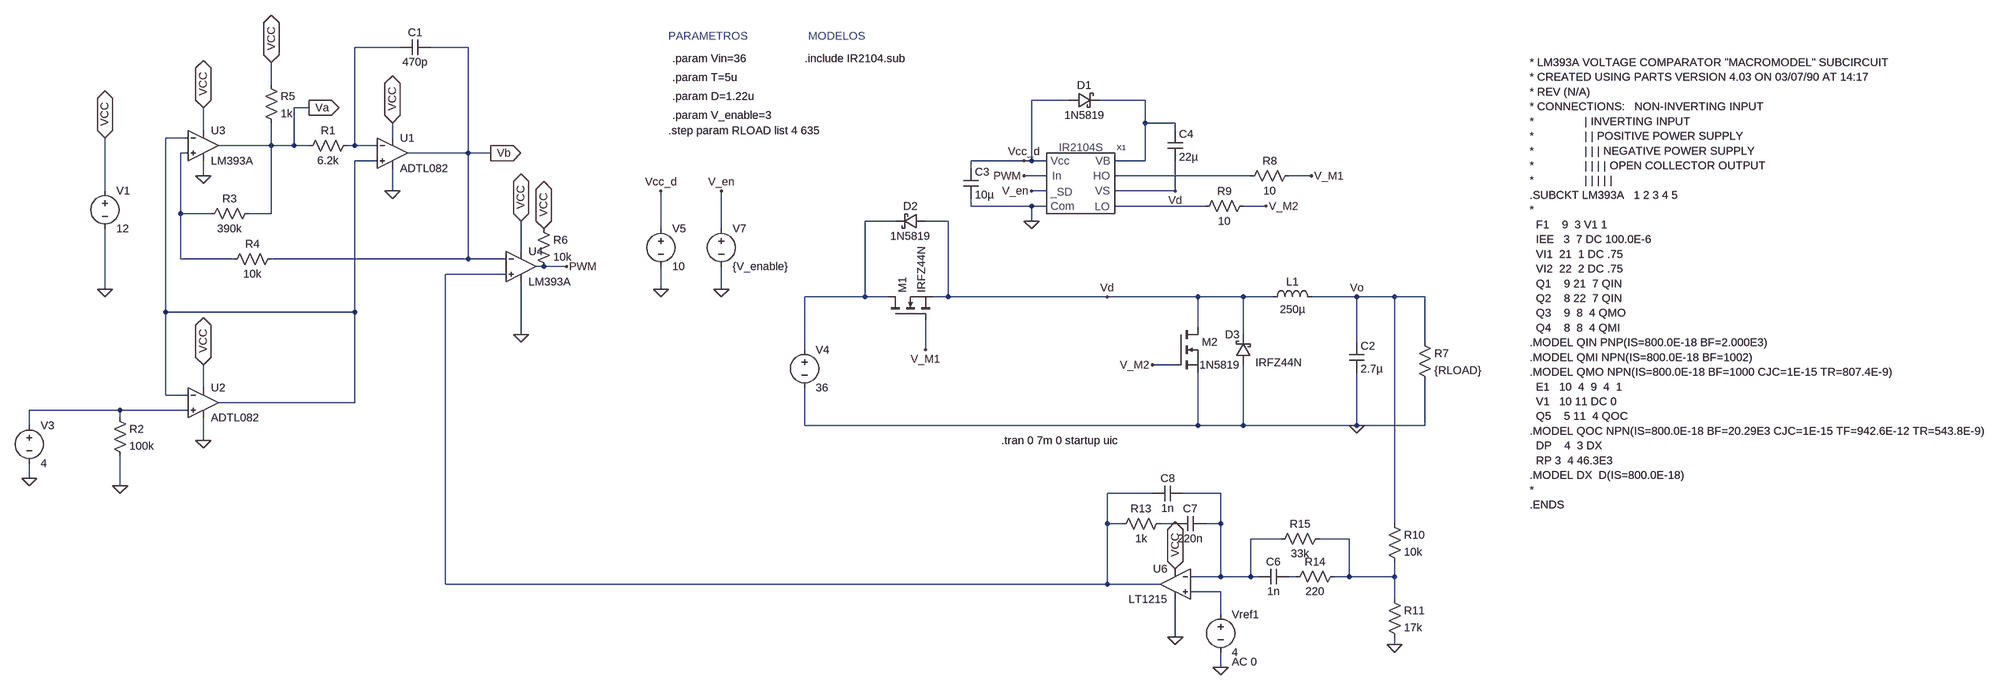
[diagram p0: schematic buck_lazo_cerrado.asc]
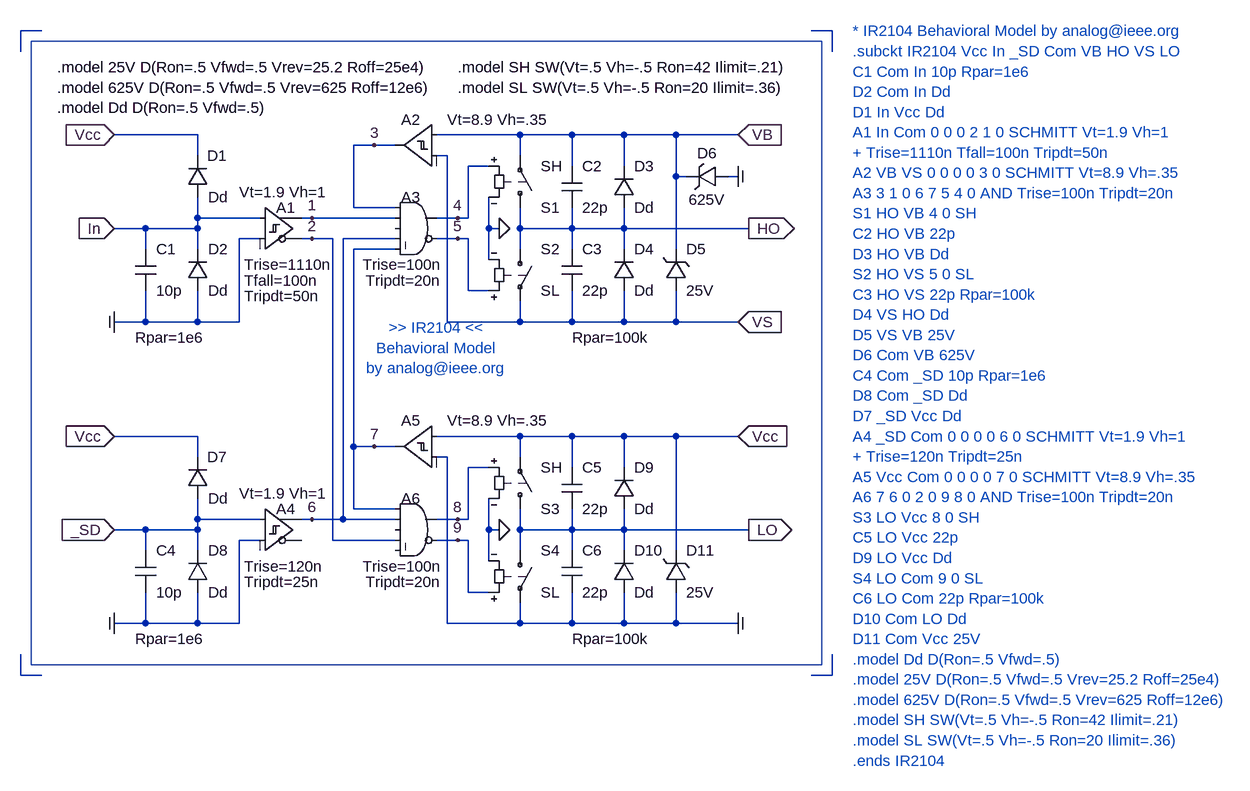
[diagram p1: sub-circuit ir2104.asc]
buck_lazo_cerrado.asc, the LTspice schematic file:
Version 4
SHEET 1 4080 1172
WIRE 528 -288 432 -288
WIRE 672 -288 592 -288
WIRE 256 -208 256 -256
WIRE 1952 -176 1872 -176
WIRE 2112 -176 2016 -176
WIRE 336 -160 304 -160
WIRE 2112 -128 2112 -176
WIRE 2176 -128 2112 -128
WIRE 112 -112 112 -160
WIRE 2176 -112 2176 -128
WIRE 80 -96 32 -96
WIRE 512 -96 512 -128
WIRE 256 -80 256 -128
WIRE 256 -80 144 -80
WIRE 304 -80 304 -160
WIRE 304 -80 256 -80
WIRE 336 -80 304 -80
WIRE 432 -80 432 -288
WIRE 432 -80 416 -80
WIRE 480 -80 432 -80
WIRE 80 -64 64 -64
WIRE 672 -64 672 -288
WIRE 672 -64 544 -64
WIRE 720 -64 672 -64
WIRE 480 -48 432 -48
WIRE 1856 -48 1744 -48
WIRE 1872 -48 1872 -176
WIRE 1872 -48 1856 -48
WIRE 1904 -48 1872 -48
WIRE 2112 -48 2112 -128
WIRE 2112 -48 2048 -48
WIRE 1744 -32 1744 -48
WIRE 112 -16 112 -48
WIRE 1904 -16 1856 -16
WIRE 2336 -16 2048 -16
WIRE 2464 -16 2416 -16
WIRE -96 16 -96 -96
WIRE 512 16 512 -32
WIRE 1904 16 1872 16
WIRE 2176 16 2176 -48
WIRE 2176 16 2048 16
WIRE 1744 48 1744 32
WIRE 1872 48 1744 48
WIRE 1904 48 1872 48
WIRE 2240 48 2048 48
WIRE 2368 48 2320 48
WIRE 64 64 64 -64
WIRE 128 64 64 64
WIRE 256 64 256 -80
WIRE 256 64 208 64
WIRE 1584 80 1520 80
WIRE 1696 80 1648 80
WIRE 1872 80 1872 48
WIRE 1088 96 1088 16
WIRE 1216 96 1216 16
WIRE 784 144 784 80
WIRE 64 160 64 64
WIRE 176 160 64 160
WIRE 672 160 672 -64
WIRE 672 160 256 160
WIRE 752 160 672 160
WIRE 832 176 816 176
WIRE 880 176 832 176
WIRE 752 192 624 192
WIRE -96 224 -96 96
WIRE 1088 224 1088 176
WIRE 1216 224 1216 176
WIRE 1520 240 1520 80
WIRE 1520 240 1392 240
WIRE 1568 240 1520 240
WIRE 1696 240 1696 80
WIRE 1696 240 1664 240
WIRE 2032 240 1696 240
WIRE 2224 240 2032 240
WIRE 2320 240 2224 240
WIRE 2384 240 2320 240
WIRE 2560 240 2464 240
WIRE 2640 240 2560 240
WIRE 2704 240 2640 240
WIRE 32 272 32 -96
WIRE 432 272 432 -48
WIRE 432 272 32 272
WIRE 2224 304 2224 240
WIRE 784 320 784 208
WIRE 2320 320 2320 240
WIRE 2560 336 2560 240
WIRE 2704 336 2704 240
WIRE 1392 352 1392 240
WIRE 1648 352 1648 288
WIRE 2176 384 2128 384
WIRE 112 432 112 384
WIRE 32 448 32 272
WIRE 80 448 32 448
WIRE 432 464 432 272
WIRE 432 464 144 464
WIRE -64 480 -256 480
WIRE 80 480 -64 480
WIRE -64 496 -64 480
WIRE -256 512 -256 480
WIRE 1392 512 1392 432
WIRE 2224 512 2224 400
WIRE 2224 512 1392 512
WIRE 2320 512 2320 384
WIRE 2320 512 2224 512
WIRE 2560 512 2560 400
WIRE 2560 512 2320 512
WIRE 2704 512 2704 416
WIRE 2704 512 2560 512
WIRE 112 544 112 496
WIRE -256 624 -256 592
WIRE -64 640 -64 576
WIRE 2128 656 2032 656
WIRE 2272 656 2192 656
WIRE 2032 720 2032 656
WIRE 2064 720 2032 720
WIRE 2176 720 2144 720
WIRE 2272 720 2272 656
WIRE 2272 720 2240 720
WIRE 2640 720 2640 240
WIRE 2400 752 2336 752
WIRE 2544 752 2480 752
WIRE 2272 832 2272 720
WIRE 2272 832 2208 832
WIRE 2336 832 2336 752
WIRE 2336 832 2272 832
WIRE 2352 832 2336 832
WIRE 2432 832 2416 832
WIRE 2544 832 2544 752
WIRE 2544 832 2512 832
WIRE 2640 832 2640 800
WIRE 2640 832 2544 832
WIRE 624 848 624 192
WIRE 2032 848 2032 720
WIRE 2032 848 624 848
WIRE 2144 848 2032 848
WIRE 2272 864 2208 864
WIRE 2640 880 2640 832
WIRE 2272 912 2272 864
WIRE 2176 960 2176 880
WIRE 2640 976 2640 960
WIRE 2272 1024 2272 992
FLAG -64 640 0
FLAG -96 224 0
FLAG 512 16 0
FLAG 112 544 0
FLAG 784 320 0
FLAG 112 -16 0
FLAG -96 -96 VCC
IOPIN -96 -96 BiDir
FLAG 112 -160 VCC
IOPIN 112 -160 BiDir
FLAG 512 -128 VCC
IOPIN 512 -128 BiDir
FLAG 112 384 VCC
IOPIN 112 384 BiDir
FLAG 336 -160 Va
IOPIN 336 -160 Out
FLAG 720 -64 Vb
IOPIN 720 -64 Out
FLAG 784 80 VCC
IOPIN 784 80 BiDir
FLAG -256 624 0
FLAG 256 -256 VCC
IOPIN 256 -256 BiDir
FLAG 832 96 VCC
IOPIN 832 96 BiDir
FLAG 2560 512 0
FLAG 2560 240 Vo
FLAG 2032 240 Vd
FLAG 1856 -16 PWM
FLAG 1088 224 0
FLAG 1088 16 Vcc_d
FLAG 1856 -48 Vcc_d
FLAG 2176 16 Vd
FLAG 1872 80 0
FLAG 2464 -16 V_M1
FLAG 2368 48 V_M2
FLAG 1648 352 V_M1
FLAG 2128 384 V_M2
FLAG 1872 16 V_en
FLAG 1216 224 0
FLAG 1216 16 V_en
FLAG 880 176 PWM
FLAG 2176 960 0
FLAG 2272 1024 0
FLAG 2640 976 0
FLAG 2176 816 VCC
IOPIN 2176 816 BiDir
SYMBOL res 432 -96 R90
WINDOW 0 0 56 VBottom 2
WINDOW 3 32 56 VTop 2
SYMATTR InstName R1
SYMATTR Value 6.2k
SYMBOL res -80 480 R0
SYMATTR InstName R2
SYMATTR Value 100k
SYMBOL voltage -96 0 R0
WINDOW 123 0 0 Left 0
WINDOW 39 0 0 Left 0
SYMATTR InstName V1
SYMATTR Value 12
SYMBOL res 224 48 R90
WINDOW 0 0 56 VBottom 2
WINDOW 3 32 56 VTop 2
SYMATTR InstName R3
SYMATTR Value 390k
SYMBOL res 272 144 R90
WINDOW 0 0 56 VBottom 2
WINDOW 3 32 56 VTop 2
SYMATTR InstName R4
SYMATTR Value 10k
SYMBOL cap 592 -304 R90
WINDOW 0 0 32 VBottom 2
WINDOW 3 32 32 VTop 2
SYMATTR InstName C1
SYMATTR Value 470p
SYMBOL OpAmps\\ADTL082 512 -128 R0
SYMATTR InstName U1
SYMBOL OpAmps\\ADTL082 112 400 R0
SYMATTR InstName U2
SYMBOL voltage -256 496 R0
WINDOW 123 0 0 Left 0
WINDOW 39 0 0 Left 0
SYMATTR InstName V3
SYMATTR Value 4
SYMBOL OpAmps\\opamp2 112 -144 R0
SYMATTR InstName U3
SYMATTR Value LM393A
SYMBOL res 240 -224 R0
SYMATTR InstName R5
SYMATTR Value 1k
SYMBOL OpAmps\\opamp2 784 112 R0
SYMATTR InstName U4
SYMATTR Value LM393A
SYMBOL res 816 80 R0
SYMATTR InstName R6
SYMATTR Value 10k
SYMBOL voltage 1392 336 R0
WINDOW 123 0 0 Left 0
WINDOW 39 0 0 Left 0
SYMATTR InstName V4
SYMATTR Value 36
SYMBOL ind 2368 256 R270
WINDOW 0 32 56 VTop 2
WINDOW 3 5 56 VBottom 2
SYMATTR InstName L1
SYMATTR Value 250µ
SYMBOL cap 2544 336 R0
SYMATTR InstName C2
SYMATTR Value 2.7µ
SYMBOL res 2688 320 R0
SYMATTR InstName R7
SYMATTR Value {RLOAD}
SYMBOL nmos 1568 288 R270
SYMATTR InstName M1
SYMATTR Value IRFZ44N
SYMBOL nmos 2176 304 R0
WINDOW 3 170 75 Left 2
SYMATTR Value IRFZ44N
SYMATTR InstName M2
SYMBOL voltage 1088 80 R0
SYMATTR InstName V5
SYMATTR Value 10
SYMBOL cap 1728 -32 R0
SYMATTR InstName C3
SYMATTR Value 10µ
SYMBOL schottky 1952 -160 R270
WINDOW 0 32 32 VTop 2
WINDOW 3 0 32 VBottom 2
SYMATTR InstName D1
SYMATTR Value 1N5819
SYMATTR Description Diode
SYMATTR Type diode
SYMBOL res 2432 -32 R90
WINDOW 0 0 56 VBottom 2
WINDOW 3 32 56 VTop 2
SYMATTR InstName R8
SYMATTR Value 10
SYMBOL res 2336 32 R90
WINDOW 0 0 56 VBottom 2
WINDOW 3 32 56 VTop 2
SYMATTR InstName R9
SYMATTR Value 10
SYMBOL cap 2160 -112 R0
SYMATTR InstName C4
SYMATTR Value 22µ
SYMBOL voltage 1216 80 R0
WINDOW 123 0 0 Left 0
WINDOW 39 0 0 Left 0
SYMATTR InstName V7
SYMATTR Value {V_enable}
SYMBOL ir2104 1936 -32 R0
SYMATTR InstName X1
SYMBOL cap 2416 816 R90
WINDOW 0 0 32 VBottom 2
WINDOW 3 32 32 VTop 2
SYMATTR InstName C6
SYMATTR Value 1n
SYMBOL cap 2240 704 R90
WINDOW 0 0 32 VBottom 2
WINDOW 3 32 32 VTop 2
SYMATTR InstName C7
SYMATTR Value 220n
SYMBOL res 2160 704 R90
WINDOW 0 0 56 VBottom 2
WINDOW 3 32 56 VTop 2
SYMATTR InstName R13
SYMATTR Value 1k
SYMBOL res 2528 816 R90
WINDOW 0 0 56 VBottom 2
WINDOW 3 32 56 VTop 2
SYMATTR InstName R14
SYMATTR Value 220
SYMBOL res 2496 736 R90
WINDOW 0 0 56 VBottom 2
WINDOW 3 32 56 VTop 2
SYMATTR InstName R15
SYMATTR Value 33k
SYMBOL voltage 2272 896 R0
WINDOW 123 24 116 Left 2
WINDOW 39 0 0 Left 2
SYMATTR Value2 AC 0
SYMATTR InstName Vref1
SYMATTR Value 4
SYMBOL cap 2192 640 R90
WINDOW 0 0 32 VBottom 2
WINDOW 3 32 32 VTop 2
SYMATTR InstName C8
SYMATTR Value 1n
SYMBOL res 2624 704 R0
SYMATTR InstName R10
SYMATTR Value 10k
SYMBOL res 2624 864 R0
SYMATTR InstName R11
SYMATTR Value 17k
SYMBOL schottky 1648 64 R90
WINDOW 0 0 32 VBottom 2
WINDOW 3 32 32 VTop 2
SYMATTR InstName D2
SYMATTR Value 1N5819
SYMATTR Description Diode
SYMATTR Type diode
SYMBOL schottky 2336 384 R180
WINDOW 0 24 64 Left 2
WINDOW 3 24 0 Left 2
SYMATTR InstName D3
SYMATTR Value 1N5819
SYMATTR Description Diode
SYMATTR Type diode
SYMBOL OpAmps\\LT1215 2176 784 M0
SYMATTR InstName U6
TEXT 1808 544 Left 2 !.tran 0 7m 0 startup uic
TEXT 1392 -264 Left 2 !.include IR2104.sub
TEXT 1112 -264 Left 2 !.param Vin=36
TEXT 1104 -312 Left 2 ;PARAMETROS
TEXT 1112 -224 Left 2 !.param T=5u
TEXT 1112 -184 Left 2 !.param D=1.22u
TEXT 1112 -144 Left 2 !.param V_enable=3
TEXT 1400 -312 Left 2 ;MODELOS
TEXT 3072 -256 Left 2 !* LM393A VOLTAGE COMPARATOR "MACROMODEL" SUBCIRCUIT\n* CREATED USING PARTS VERSION 4.03 ON 03/07/90 AT 14:17\n* REV (N/A)\n* CONNECTIONS:   NON-INVERTING INPUT\n*                | INVERTING INPUT\n*                | | POSITIVE POWER SUPPLY\n*                | | | NEGATIVE POWER SUPPLY\n*                | | | | OPEN COLLECTOR OUTPUT\n*                | | | | |\n.SUBCKT LM393A   1 2 3 4 5\n*\n  F1    9  3 V1 1\n  IEE   3  7 DC 100.0E-6\n  VI1  21  1 DC .75\n  VI2  22  2 DC .75\n  Q1    9 21  7 QIN\n  Q2    8 22  7 QIN\n  Q3    9  8  4 QMO\n  Q4    8  8  4 QMI\n.MODEL QIN PNP(IS=800.0E-18 BF=2.000E3)\n.MODEL QMI NPN(IS=800.0E-18 BF=1002)\n.MODEL QMO NPN(IS=800.0E-18 BF=1000 CJC=1E-15 TR=807.4E-9)\n  E1   10  4  9  4  1\n  V1   10 11 DC 0\n  Q5    5 11  4 QOC\n.MODEL QOC NPN(IS=800.0E-18 BF=20.29E3 CJC=1E-15 TF=942.6E-12 TR=543.8E-9)\n  DP    4  3 DX\n  RP 3  4 46.3E3\n.MODEL DX  D(IS=800.0E-18)\n*\n.ENDS
TEXT 1104 -112 Left 2 !.step param RLOAD list 4 635

ir2104.asc, the sub-circuit schematic file:
Version 4
SHEET 1 1888 1048
WIRE -400 -560 -400 -592
WIRE -400 400 -400 368
WIRE -368 -592 -400 -592
WIRE -368 400 -400 400
WIRE -208 -288 -256 -288
WIRE -208 -256 -208 -288
WIRE -208 -144 -256 -144
WIRE -208 -144 -208 -192
WIRE -208 176 -256 176
WIRE -208 208 -208 176
WIRE -208 320 -256 320
WIRE -208 320 -208 272
WIRE -128 -432 -256 -432
WIRE -128 -400 -128 -432
WIRE -128 -304 -128 -336
WIRE -128 -288 -208 -288
WIRE -128 -288 -128 -304
WIRE -128 -256 -128 -288
WIRE -128 -144 -208 -144
WIRE -128 -144 -128 -192
WIRE -128 32 -256 32
WIRE -128 64 -128 32
WIRE -128 160 -128 128
WIRE -128 176 -208 176
WIRE -128 176 -128 160
WIRE -128 208 -128 176
WIRE -128 320 -208 320
WIRE -128 320 -128 272
WIRE -64 -144 -128 -144
WIRE -64 -144 -64 -272
WIRE -64 320 -128 320
WIRE -64 320 -64 192
WIRE -32 -304 -128 -304
WIRE -32 -272 -64 -272
WIRE -32 160 -128 160
WIRE -32 192 -64 192
WIRE 48 -304 32 -304
WIRE 48 -272 32 -272
WIRE 48 160 32 160
WIRE 80 -272 48 -272
WIRE 80 192 80 -272
WIRE 96 160 48 160
WIRE 96 160 96 -272
WIRE 112 -320 112 -416
WIRE 112 48 112 -256
WIRE 112 144 112 48
WIRE 144 -416 112 -416
WIRE 144 48 112 48
WIRE 176 -416 144 -416
WIRE 176 -320 112 -320
WIRE 176 -304 48 -304
WIRE 176 -272 96 -272
WIRE 176 -256 112 -256
WIRE 176 48 144 48
WIRE 176 144 112 144
WIRE 176 160 96 160
WIRE 176 192 80 192
WIRE 256 -400 240 -400
WIRE 256 -144 256 -400
WIRE 256 64 240 64
WIRE 256 320 256 64
WIRE 272 -304 240 -304
WIRE 272 -272 240 -272
WIRE 272 160 240 160
WIRE 272 192 240 192
WIRE 288 -304 272 -304
WIRE 288 -304 288 -384
WIRE 288 -272 272 -272
WIRE 288 -192 288 -272
WIRE 288 160 272 160
WIRE 288 160 288 80
WIRE 288 192 272 192
WIRE 288 272 288 192
WIRE 320 -384 288 -384
WIRE 320 -288 320 -336
WIRE 320 -240 320 -288
WIRE 320 -192 288 -192
WIRE 320 80 288 80
WIRE 320 176 320 128
WIRE 320 224 320 176
WIRE 320 272 288 272
WIRE 336 -288 320 -288
WIRE 336 176 320 176
WIRE 368 -432 240 -432
WIRE 368 -400 368 -432
WIRE 368 -288 368 -320
WIRE 368 -256 368 -288
WIRE 368 -144 256 -144
WIRE 368 -144 368 -176
WIRE 368 32 240 32
WIRE 368 64 368 32
WIRE 368 176 368 144
WIRE 368 208 368 176
WIRE 368 320 256 320
WIRE 368 320 368 288
WIRE 448 -432 368 -432
WIRE 448 -384 448 -432
WIRE 448 -288 368 -288
WIRE 448 -288 448 -320
WIRE 448 -256 448 -288
WIRE 448 -144 368 -144
WIRE 448 -144 448 -192
WIRE 448 32 368 32
WIRE 448 80 448 32
WIRE 448 176 368 176
WIRE 448 176 448 144
WIRE 448 208 448 176
WIRE 448 320 368 320
WIRE 448 320 448 272
WIRE 528 -432 448 -432
WIRE 528 -384 528 -432
WIRE 528 -288 448 -288
WIRE 528 -288 528 -320
WIRE 528 -256 528 -288
WIRE 528 -144 448 -144
WIRE 528 -144 528 -192
WIRE 528 32 448 32
WIRE 528 80 528 32
WIRE 528 176 448 176
WIRE 528 176 528 144
WIRE 528 208 528 176
WIRE 528 320 448 320
WIRE 528 320 528 272
WIRE 608 -432 528 -432
WIRE 608 -368 608 -432
WIRE 608 -256 608 -368
WIRE 608 -144 528 -144
WIRE 608 -144 608 -192
WIRE 608 32 528 32
WIRE 608 208 608 32
WIRE 608 320 528 320
WIRE 608 320 608 272
WIRE 624 -368 608 -368
WIRE 704 -432 608 -432
WIRE 704 -368 688 -368
WIRE 704 -144 608 -144
WIRE 704 32 608 32
WIRE 704 320 608 320
WIRE 720 -288 528 -288
WIRE 720 176 528 176
WIRE 848 -592 816 -592
WIRE 848 -560 848 -592
WIRE 848 400 816 400
WIRE 848 400 848 368
FLAG 720 -288 HO
IOPIN 720 -288 Out
FLAG -256 -288 In
IOPIN -256 -288 In
FLAG -256 -432 Vcc
IOPIN -256 -432 In
FLAG 704 -432 VB
IOPIN 704 -432 In
FLAG 704 -144 VS
IOPIN 704 -144 In
FLAG -256 -144 Com
IOPIN -256 -144 In
FLAG 704 -368 Com
IOPIN 704 -368 In
FLAG -256 176 _SD
IOPIN -256 176 In
FLAG -256 32 Vcc
IOPIN -256 32 In
FLAG -256 320 Com
IOPIN -256 320 In
FLAG 704 32 Vcc
IOPIN 704 32 In
FLAG 704 320 Com
IOPIN 704 320 In
FLAG 720 176 LO
IOPIN 720 176 Out
FLAG 48 -304 1
FLAG 48 -272 2
FLAG 144 -416 3
FLAG 336 176 0
FLAG 336 -288 0
FLAG 144 48 7
FLAG 272 -304 4
FLAG 272 -272 5
FLAG 48 160 6
FLAG 272 160 8
FLAG 272 192 9
SYMBOL diode -144 -336 M180
WINDOW 0 31 64 Left 0
WINDOW 3 32 0 Left 0
SYMATTR InstName D1
SYMATTR Value Dd
SYMBOL diode -144 -192 M180
WINDOW 0 32 64 Left 0
WINDOW 3 32 0 Left 0
SYMATTR InstName D2
SYMATTR Value Dd
SYMBOL diode 512 -320 M180
WINDOW 0 32 64 Left 0
WINDOW 3 32 0 Left 0
SYMATTR InstName D3
SYMATTR Value Dd
SYMBOL diode 512 -192 M180
WINDOW 0 32 64 Left 0
WINDOW 3 32 0 Left 0
SYMATTR InstName D4
SYMATTR Value Dd
SYMBOL zener 592 -192 M180
WINDOW 0 32 64 Left 0
WINDOW 3 32 0 Left 0
SYMATTR InstName D5
SYMATTR Value 25V
SYMBOL cap 432 -384 R0
WINDOW 0 32 0 Left 0
WINDOW 3 32 64 Left 0
SYMATTR InstName C2
SYMATTR Value 22p
SYMBOL cap 432 -256 R0
WINDOW 0 32 0 Left 0
WINDOW 3 32 64 Left 0
WINDOW 39 16 136 Left 0
SYMATTR InstName C3
SYMATTR Value 22p
SYMATTR SpiceLine Rpar=100k
SYMBOL sw 368 -304 M180
WINDOW 0 32 16 Left 0
WINDOW 3 32 80 Left 0
SYMATTR InstName S1
SYMATTR Value SH
SYMBOL sw 368 -272 R0
WINDOW 0 32 16 Left 0
WINDOW 3 32 80 Left 0
SYMATTR InstName S2
SYMATTR Value SL
SYMBOL Digital\\diffschmtbuf 240 -480 M0
WINDOW 0 40 25 Center 0
WINDOW 3 -16 25 Right 0
SYMATTR InstName A2
SYMATTR Value Vt=8.9 Vh=.35
SYMBOL cap -224 -256 R0
WINDOW 0 32 0 Left 0
WINDOW 3 32 64 Left 0
WINDOW 39 0 136 Left 0
SYMATTR InstName C1
SYMATTR Value 10p
SYMATTR SpiceLine Rpar=1e6
SYMBOL zener 688 -352 M270
WINDOW 0 36 32 VTop 0
WINDOW 3 -4 32 VBottom 0
SYMATTR InstName D6
SYMATTR Value 625V
SYMBOL diode -144 128 M180
WINDOW 0 31 64 Left 0
WINDOW 3 32 0 Left 0
SYMATTR InstName D7
SYMATTR Value Dd
SYMBOL diode -144 272 M180
WINDOW 0 32 64 Left 0
WINDOW 3 32 0 Left 0
SYMATTR InstName D8
SYMATTR Value Dd
SYMBOL Digital\\diffschmitt -32 112 R0
WINDOW 0 40 32 Center 0
WINDOW 3 -32 8 Left 0
WINDOW 123 -24 120 Left 0
WINDOW 39 -24 144 Left 0
SYMATTR InstName A4
SYMATTR Value Vt=1.9 Vh=1
SYMATTR Value2 Trise=120n
SYMATTR SpiceLine Tripdt=25n
SYMBOL Digital\\diffschmtbuf 240 -16 M0
WINDOW 0 40 24 Center 0
WINDOW 3 -16 24 Right 0
SYMATTR InstName A5
SYMATTR Value Vt=8.9 Vh=.35
SYMBOL cap -224 208 R0
WINDOW 0 32 0 Left 0
WINDOW 3 32 64 Left 0
WINDOW 39 0 136 Left 0
SYMATTR InstName C4
SYMATTR Value 10p
SYMATTR SpiceLine Rpar=1e6
SYMBOL sw 368 160 M180
WINDOW 0 32 16 Left 0
WINDOW 3 32 80 Left 0
SYMATTR InstName S3
SYMATTR Value SH
SYMBOL sw 368 192 R0
WINDOW 0 32 16 Left 0
WINDOW 3 32 80 Left 0
SYMATTR InstName S4
SYMATTR Value SL
SYMBOL diode 512 144 M180
WINDOW 0 32 64 Left 0
WINDOW 3 32 0 Left 0
SYMATTR InstName D9
SYMATTR Value Dd
SYMBOL diode 512 272 M180
WINDOW 0 32 64 Left 0
WINDOW 3 32 0 Left 0
SYMATTR InstName D10
SYMATTR Value Dd
SYMBOL zener 592 272 M180
WINDOW 0 32 64 Left 0
WINDOW 3 32 0 Left 0
SYMATTR InstName D11
SYMATTR Value 25V
SYMBOL cap 432 80 R0
WINDOW 0 32 0 Left 0
WINDOW 3 32 64 Left 0
SYMATTR InstName C5
SYMATTR Value 22p
SYMBOL cap 432 208 R0
WINDOW 0 32 0 Left 0
WINDOW 3 32 64 Left 0
WINDOW 39 16 136 Left 0
SYMATTR InstName C6
SYMATTR Value 22p
SYMATTR SpiceLine Rpar=100k
SYMBOL Digital\\and 208 -352 R0
WINDOW 0 -8 16 Center 0
WINDOW 3 40 120 Right 0
WINDOW 123 40 144 Right 0
SYMATTR InstName A3
SYMATTR Value Trise=100n
SYMATTR Value2 Tripdt=20n
SYMBOL Digital\\and 208 112 R0
WINDOW 0 -8 16 Center 0
WINDOW 3 40 120 Right 0
WINDOW 123 40 144 Right 0
SYMATTR InstName A6
SYMATTR Value Trise=100n
SYMATTR Value2 Tripdt=20n
SYMBOL Digital\\diffschmitt -32 -352 R0
WINDOW 0 40 32 Center 0
WINDOW 3 -32 8 Left 0
WINDOW 123 -24 120 Left 0
WINDOW 39 -24 144 Left 0
WINDOW 40 -24 168 Left 0
SYMATTR InstName A1
SYMATTR Value Vt=1.9 Vh=1
SYMATTR Value2 Trise=1110n
SYMATTR SpiceLine Tfall=100n
SYMATTR SpiceLine2 Tripdt=50n
TEXT 240 -104 Center 0 ;>> IR2104 <<\nBehavioral Model\nby analog@ieee.org
TEXT -344 -536 Left 0 !.model 25V D(Ron=.5 Vfwd=.5 Vrev=25.2 Roff=25e4)\n.model 625V D(Ron=.5 Vfwd=.5 Vrev=625 Roff=12e6)\n.model Dd D(Ron=.5 Vfwd=.5)
TEXT 272 -536 Left 0 !.model SH SW(Vt=.5 Vh=-.5 Ron=42 Ilimit=.21)\n.model SL SW(Vt=.5 Vh=-.5 Ron=20 Ilimit=.36)
TEXT 880 -592 Left 0 ;* IR2104 Behavioral Model by analog@ieee.org\n.subckt IR2104 Vcc In _SD Com VB HO VS LO\nC1 Com In 10p Rpar=1e6\nD2 Com In Dd\nD1 In Vcc Dd\nA1 In Com 0 0 0 2 1 0 SCHMITT Vt=1.9 Vh=1\n+ Trise=1110n Tfall=100n Tripdt=50n\nA2 VB VS 0 0 0 0 3 0 SCHMITT Vt=8.9 Vh=.35\nA3 3 1 0 6 7 5 4 0 AND Trise=100n Tripdt=20n\nS1 HO VB 4 0 SH\nC2 HO VB 22p\nD3 HO VB Dd\nS2 HO VS 5 0 SL\nC3 HO VS 22p Rpar=100k\nD4 VS HO Dd\nD5 VS VB 25V\nD6 Com VB 625V\nC4 Com _SD 10p Rpar=1e6\nD8 Com _SD Dd\nD7 _SD Vcc Dd\nA4 _SD Com 0 0 0 0 6 0 SCHMITT Vt=1.9 Vh=1\n+ Trise=120n Tripdt=25n\nA5 Vcc Com 0 0 0 0 7 0 SCHMITT Vt=8.9 Vh=.35\nA6 7 6 0 2 0 9 8 0 AND Trise=100n Tripdt=20n\nS3 LO Vcc 8 0 SH\nC5 LO Vcc 22p\nD9 LO Vcc Dd\nS4 LO Com 9 0 SL\nC6 LO Com 22p Rpar=100k\nD10 Com LO Dd\nD11 Com Vcc 25V\n.model Dd D(Ron=.5 Vfwd=.5)\n.model 25V D(Ron=.5 Vfwd=.5 Vrev=25.2 Roff=25e4)\n.model 625V D(Ron=.5 Vfwd=.5 Vrev=625 Roff=12e6)\n.model SH SW(Vt=.5 Vh=-.5 Ron=42 Ilimit=.21)\n.model SL SW(Vt=.5 Vh=-.5 Ron=20 Ilimit=.36)\n.ends IR2104
RECTANGLE Normal 832 384 -384 -576

The netlist it stands for:
* buck_lazo_cerrado.asc
R1 N001 Va 6.2k
R2 N009 0 100k
V1 VCC 0 12
R3 Va N004 390k
R4 Vb N004 10k
C1 Vb N001 470p
XU1 N003 N001 VCC 0 Vb ADTL082  ; pins In+ In- V+ V- OUT
XU2 N009 N003 VCC 0 N003 ADTL082  ; pins In+ In- V+ V- OUT
V3 N009 0 4
XU3 N004 N003 VCC 0 Va LM393A  ; pins In+ In- V+ V- OUT
R5 VCC Va 1k
XU4 N008 Vb VCC 0 PWM LM393A  ; pins In+ In- V+ V- OUT
R6 VCC PWM 10k
V4 N007 0 36
L1 Vd Vo 250µ
C2 Vo 0 2.7µ
R7 Vo 0 {RLOAD}
M1 N007 V_M1 Vd Vd IRFZ44N
M2 Vd V_M2 0 0 IRFZ44N
V5 Vcc_d 0 10
C3 Vcc_d 0 10µ
D1 Vcc_d N002 1N5819
R8 V_M1 N005 10
R9 V_M2 N006 10
C4 N002 Vd 22µ
V7 V_en 0 {V_enable}
XX1 Vcc_d PWM V_en 0 N002 N005 Vd N006 ir2104
C6 N013 N010 1n
C7 N010 N011 220n
R13 N011 N008 1k
R14 N012 N013 220
R15 N012 N010 33k
Vref1 N014 0 4 AC 0
C8 N010 N008 1n
R10 Vo N012 10k
R11 N012 0 17k
D2 Vd N007 1N5819
D3 0 Vd 1N5819
XU6 N014 N010 VCC 0 N008 LT1215  ; pins In+ In- V+ V- OUT

* block symbol definitions
.subckt ir2104 Vcc In _SD Com VB HO VS LO
D1 In Vcc Dd
D2 Com In Dd
D3 HO VB Dd
D4 VS HO Dd
D5 VS VB 25V
C2 VB HO 22p
C3 HO VS 22p Rpar=100k
S1 HO VB 4 0 SH
S2 HO VS 5 0 SL
A2 VB VS 0 0 0 0 3 0 SCHMITT Vt=8.9 Vh=.35
C1 In Com 10p Rpar=1e6
D6 Com VB 625V
D7 _SD Vcc Dd
D8 Com _SD Dd
A4 _SD Com 0 0 0 0 6 0 SCHMITT Vt=1.9 Vh=1 Trise=120n Tripdt=25n
A5 Vcc Com 0 0 0 0 7 0 SCHMITT Vt=8.9 Vh=.35
C4 _SD Com 10p Rpar=1e6
S3 LO Vcc 8 0 SH
S4 LO Com 9 0 SL
D9 LO Vcc Dd
D10 Com LO Dd
D11 Com Vcc 25V
C5 Vcc LO 22p
C6 LO Com 22p Rpar=100k
A3 3 1 0 6 7 5 4 0 AND Trise=100n Tripdt=20n
A6 7 6 0 2 0 9 8 0 AND Trise=100n Tripdt=20n
A1 In Com 0 0 0 2 1 0 SCHMITT Vt=1.9 Vh=1 Trise=1110n Tfall=100n Tripdt=50n
* >> IR2104 <<
* Behavioral Model
* by analog@ieee.org
.model 25V D(Ron=.5 Vfwd=.5 Vrev=25.2 Roff=25e4)
.model 625V D(Ron=.5 Vfwd=.5 Vrev=625 Roff=12e6)
.model Dd D(Ron=.5 Vfwd=.5)
.model SH SW(Vt=.5 Vh=-.5 Ron=42 Ilimit=.21)
.model SL SW(Vt=.5 Vh=-.5 Ron=20 Ilimit=.36)
* * IR2104 Behavioral Model by analog@ieee.org
* .subckt IR2104 Vcc In _SD Com VB HO VS LO
* C1 Com In 10p Rpar=1e6
* D2 Com In Dd
* D1 In Vcc Dd
* A1 In Com 0 0 0 2 1 0 SCHMITT Vt=1.9 Vh=1
* + Trise=1110n Tfall=100n Tripdt=50n
* A2 VB VS 0 0 0 0 3 0 SCHMITT Vt=8.9 Vh=.35
* A3 3 1 0 6 7 5 4 0 AND Trise=100n Tripdt=20n
* S1 HO VB 4 0 SH
* C2 HO VB 22p
* D3 HO VB Dd
* S2 HO VS 5 0 SL
* C3 HO VS 22p Rpar=100k
* D4 VS HO Dd
* D5 VS VB 25V
* D6 Com VB 625V
* C4 Com _SD 10p Rpar=1e6
* D8 Com _SD Dd
* D7 _SD Vcc Dd
* A4 _SD Com 0 0 0 0 6 0 SCHMITT Vt=1.9 Vh=1
* + Trise=120n Tripdt=25n
* A5 Vcc Com 0 0 0 0 7 0 SCHMITT Vt=8.9 Vh=.35
* A6 7 6 0 2 0 9 8 0 AND Trise=100n Tripdt=20n
* S3 LO Vcc 8 0 SH
* C5 LO Vcc 22p
* D9 LO Vcc Dd
* S4 LO Com 9 0 SL
* C6 LO Com 22p Rpar=100k
* D10 Com LO Dd
* D11 Com Vcc 25V
* .model Dd D(Ron=.5 Vfwd=.5)
* .model 25V D(Ron=.5 Vfwd=.5 Vrev=25.2 Roff=25e4)
* .model 625V D(Ron=.5 Vfwd=.5 Vrev=625 Roff=12e6)
* .model SH SW(Vt=.5 Vh=-.5 Ron=42 Ilimit=.21)
* .model SL SW(Vt=.5 Vh=-.5 Ron=20 Ilimit=.36)
* .ends IR2104
.ends ir2104

.model D D
.lib standard.dio
.model NMOS NMOS
.model PMOS PMOS
.lib standard.mos
.tran 0 7m 0 startup uic
.include IR2104.sub
.param Vin=36
* PARAMETROS
.param T=5u
.param D=1.22u
.param V_enable=3
* MODELOS
* LM393A VOLTAGE COMPARATOR "MACROMODEL" SUBCIRCUIT
* CREATED USING PARTS VERSION 4.03 ON 03/07/90 AT 14:17
* REV (N/A)
* CONNECTIONS:   NON-INVERTING INPUT
*                | INVERTING INPUT
*                | | POSITIVE POWER SUPPLY
*                | | | NEGATIVE POWER SUPPLY
*                | | | | OPEN COLLECTOR OUTPUT
*                | | | | |
.SUBCKT LM393A   1 2 3 4 5
*
  F1    9  3 V1 1
  IEE   3  7 DC 100.0E-6
  VI1  21  1 DC .75
  VI2  22  2 DC .75
  Q1    9 21  7 QIN
  Q2    8 22  7 QIN
  Q3    9  8  4 QMO
  Q4    8  8  4 QMI
.MODEL QIN PNP(IS=800.0E-18 BF=2.000E3)
.MODEL QMI NPN(IS=800.0E-18 BF=1002)
.MODEL QMO NPN(IS=800.0E-18 BF=1000 CJC=1E-15 TR=807.4E-9)
  E1   10  4  9  4  1
  V1   10 11 DC 0
  Q5    5 11  4 QOC
.MODEL QOC NPN(IS=800.0E-18 BF=20.29E3 CJC=1E-15 TF=942.6E-12 TR=543.8E-9)
  DP    4  3 DX
  RP 3  4 46.3E3
.MODEL DX  D(IS=800.0E-18)
*
.ENDS
.step param RLOAD list 4 635
.lib ADI.lib
.lib IR2104.sub
.lib LTC.lib
.backanno
.end